# EAGLE design M6-RF315 (EAGLE 6.1)
DESIGNER: Sandor Szilvasi; DESIGNEREMAIL: sandor.szilvasi@gmail.com; PAGE1: Cover Page; PAGE2: Radio and Antenna; REVISION: A; TITLE: M6-RF315

## Sheet 1 of 2
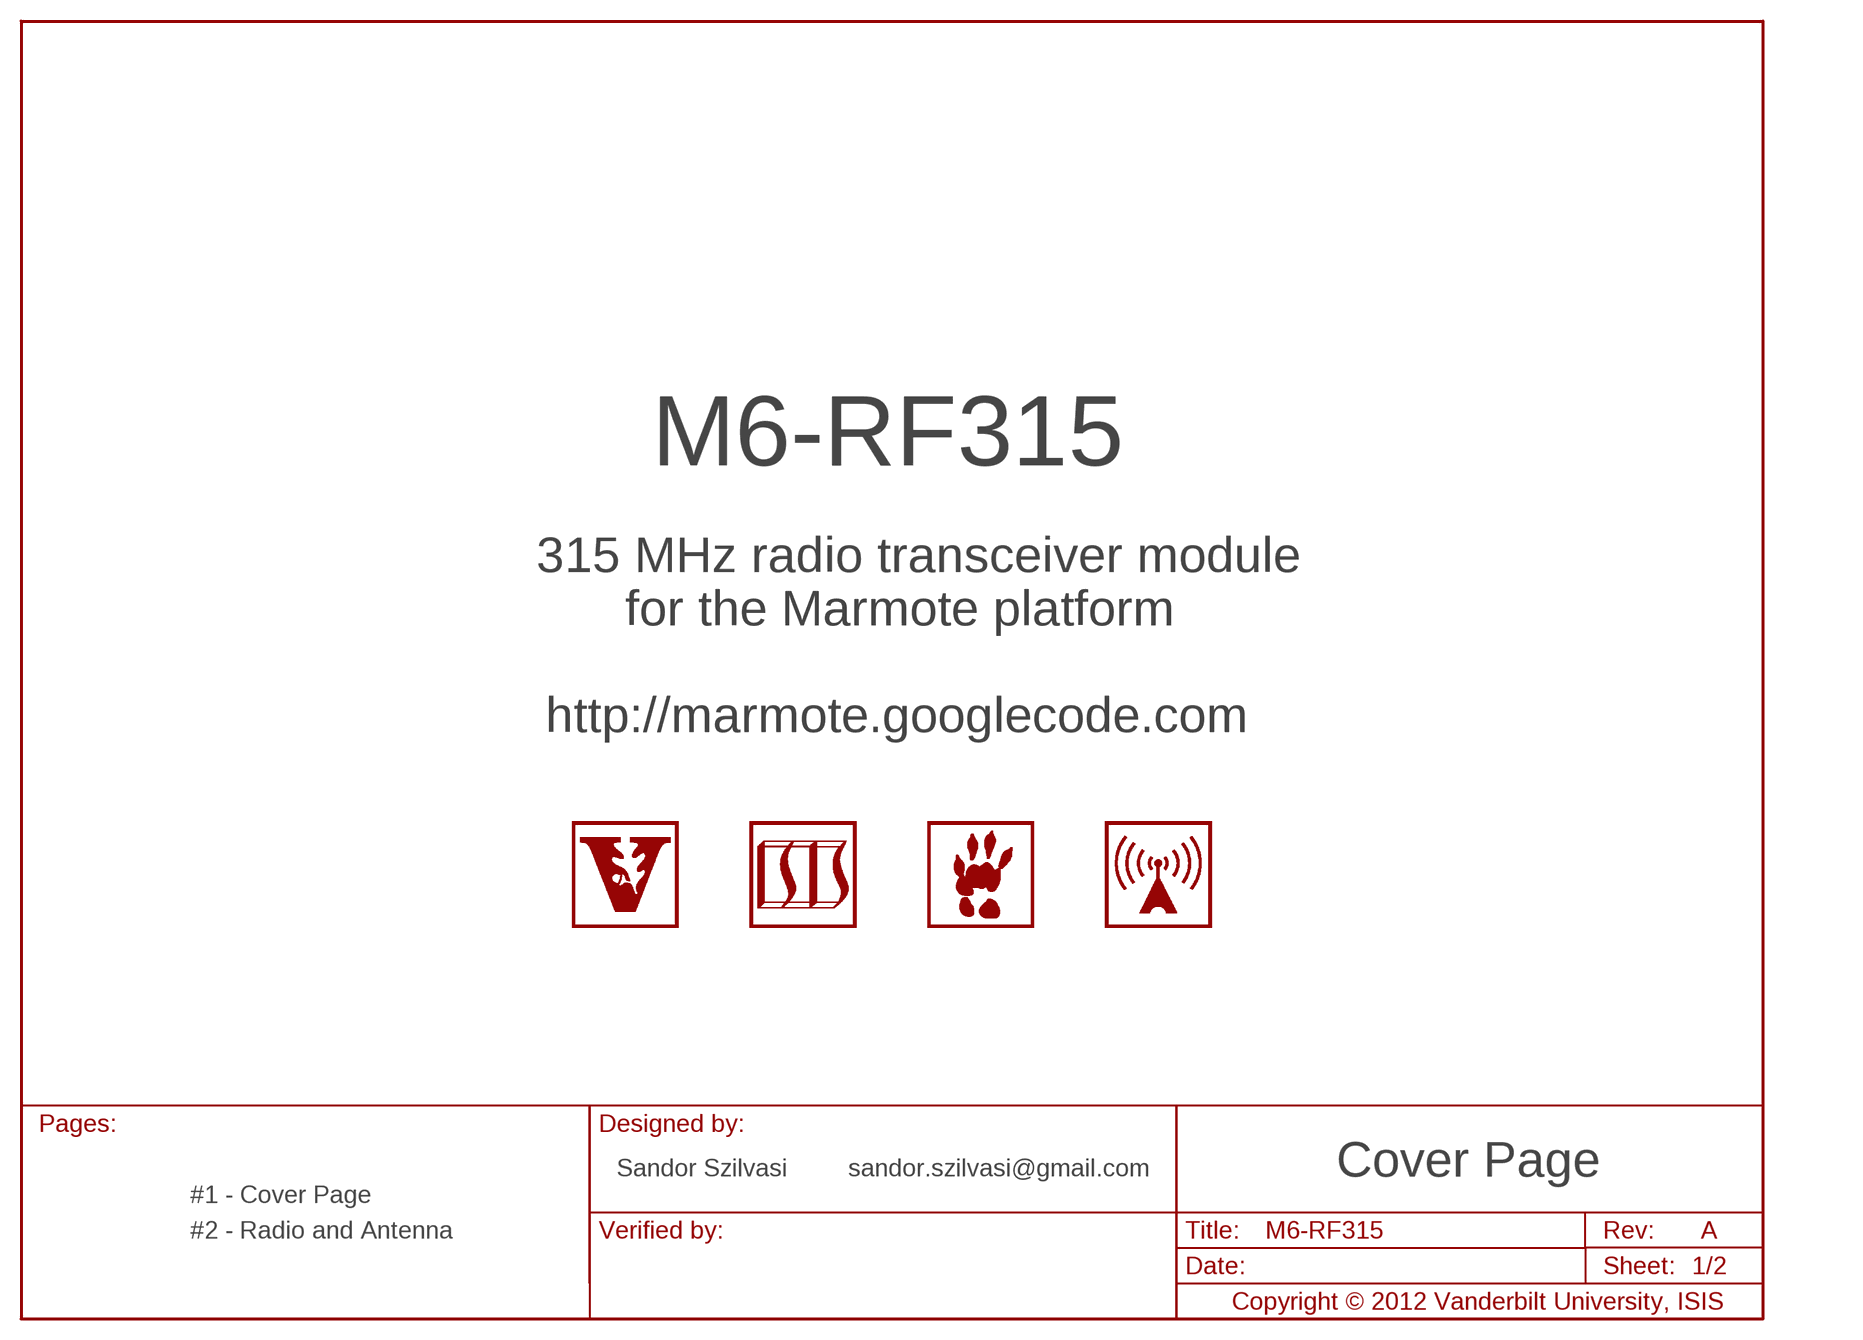
[diagram p0: schematic, sheet 1]

### Parts
LOGO1  LOGO-ISIS-600MIL-10MM-CU  [LOGO-ISIS-10MM-COPPER]
LOGO2  LOGO-MARMOTE-600MIL-10MM-CU  [LOGO-MARMOTE-10MM-COPPER]
LOGO3  LOGO-VANDERBILT-600MIL-10MM-CU  [LOGO-VANDERBILT-10MM-COPPER]
LOGO4  LOGO-RADIO-3-600MIL-10MM-CU  [LOGO-RADIO-FILLED-10MM-COPPER]

### Notes on the sheet
- 315 MHz radio transceiver module
- for the Marmote platform
- http://marmote.googlecode.com

## Sheet 2 of 2
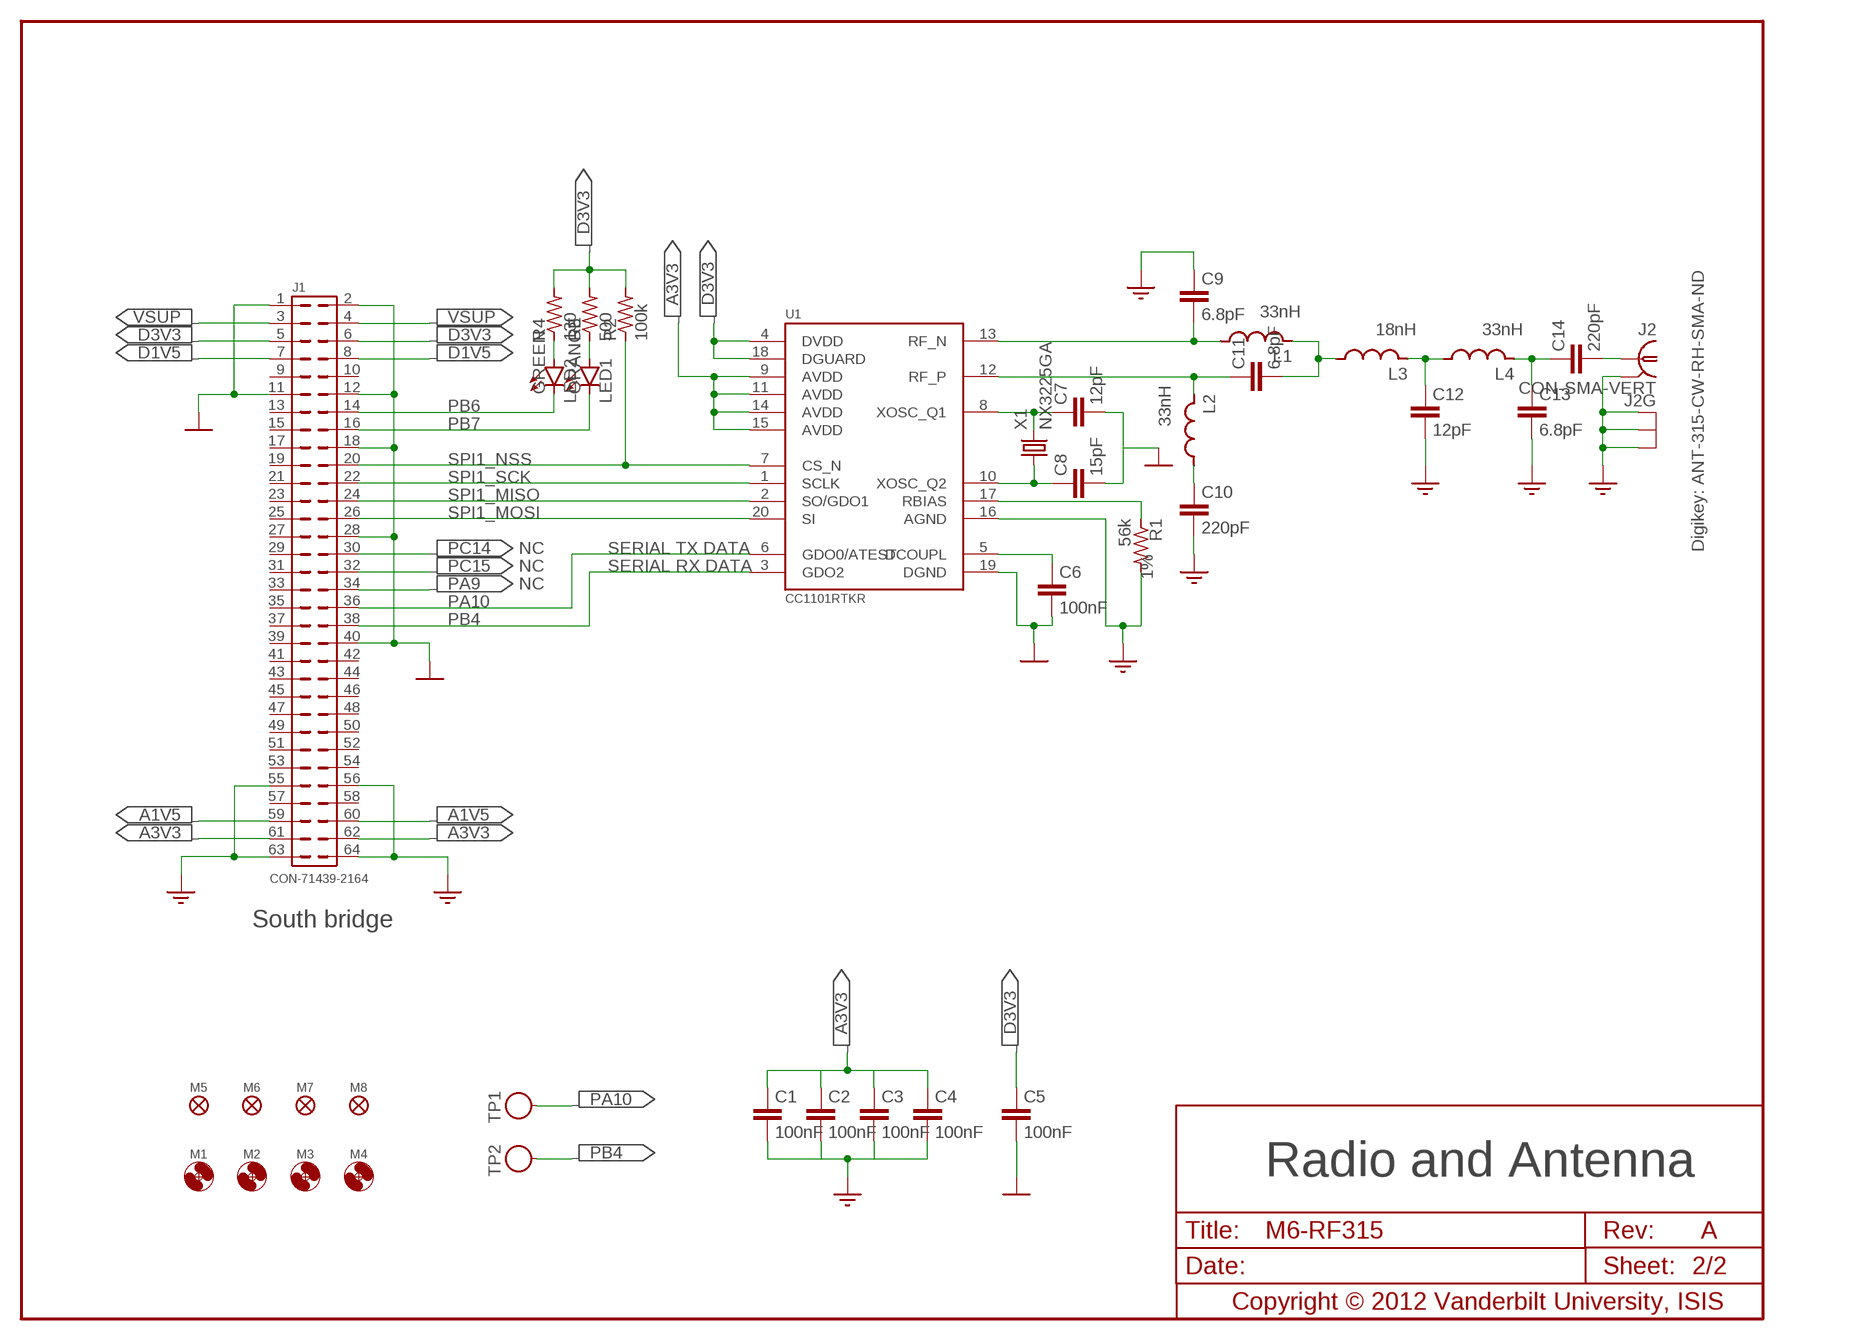
[diagram p1: schematic, sheet 2]

### Parts
C1  100nF  C0603  [C0603]
C2  100nF  C0603  [C0603]
C3  100nF  C0603  [C0603]
C4  100nF  C0603  [C0603]
C5  100nF  C0603  [C0603]
C6  100nF  C0603  [C0603]
C7  12pF  C0603  [C0603]
C8  15pF  C0603  [C0603]
C9  6.8pF  C0603  [C0603]
C10  220pF  C0603  [C0603]
C11  6.8pF  C0603  [C0603]
C12  12pF  C0603  [C0603]
C13  6.8pF  C0603  [C0603]
C14  220pF  C0603  [C0603]
J1  CON-71439-2164  [71439-XX64-BOT]
J2  CON-SMA-VERT  [SMA-VERT]
L1  33nH  L0402  [L0402]
L2  33nH  L0402  [L0402]
L3  18nH  L0402  [L0402]
L4  33nH  L0402  [L0402]
LED1  LED0603  [LED0603]
LED2  LED0603  [LED0603]
M1  MOUNT-HOLE3.3  [3,3]
M2  MOUNT-HOLE3.3  [3,3]
M3  MOUNT-HOLE3.3  [3,3]
M4  MOUNT-HOLE3.3  [3,3]
M5  FIDUCIAL1X2  [FIDUCIAL-1X2]
M6  FIDUCIAL1X2  [FIDUCIAL-1X2]
M7  FIDUCIAL1X2  [FIDUCIAL-1X2]
M8  FIDUCIAL1X2  [FIDUCIAL-1X2]
R1  56k  R0603  [R0603]
R2  100k  R0603  [R0603]
R3  500  R0603  [R0603]
R4  130  R0603  [R0603]
TP1  TESTPOINT-RED  [TESTPOINT]
TP2  TESTPOINT-RED  [TESTPOINT]
U1  CC1101RTKR  [QFN-20]
X1  NX3225GA  [NX3225GA]

### Nets
A1V5: J1.59 J1.60
A3V3: C1.1 C2.1 C3.1 C4.1 J1.61 J1.62 U1.9(AVDD) U1.11(AVDD) U1.14(AVDD) U1.15(AVDD)
AGND: C1.2 C2.2 C3.2 C4.2 C9.1 C10.2 C12.2 C13.2 J1.55 J1.56 J1.63 J1.64 J2.2(GND) J2.3(GND) J2.4(GND) J2.5(GND) R1.2 U1.16(AGND)
D1V5: J1.7 J1.8
D3V3: C5.1 J1.5 J1.6 R2.2 R3.2 R4.2 U1.4(DVDD) U1.18(DGUARD)
DGND: C5.2 C6.2 C7.2 C8.2 J1.1 J1.2 J1.11 J1.12 J1.18 J1.28 J1.40 U1.19(DGND)
N$1: LED1.A R3.1
N$2: C12.1 L3.2 L4.1
N$4: C6.1 U1.5(DCOUPL)
N$6: C8.1 U1.10(XOSC_Q2) X1.1
N$7: C7.1 U1.8(XOSC_Q1) X1.3
N$8: C11.1 L2.2 U1.12(RF_P)
N$9: C9.2 L1.1 U1.13(RF_N)
N$10: C11.2 L1.2 L3.1
N$11: C13.1 C14.1 L4.2
N$12: C14.2 J2.1
N$13: C10.1 L2.1
N$19: LED2.A R4.1
PA9: J1.34
PA10: J1.36 TP1.1 U1.6(GDO0/ATEST)
PB4: J1.38 TP2.1 U1.3(GDO2)
PB6: J1.14 LED2.C
PB7: J1.16 LED1.C
PC14: J1.30
PC15: J1.32
RBIAS: R1.1 U1.17(RBIAS)
SPI1_MISO: J1.24 U1.2(SO/GDO1)
SPI1_MOSI: J1.26 U1.20(SI)
SPI1_NSS: J1.20 R2.1 U1.7(CS_N)
SPI1_SCK: J1.22 U1.1(SCLK)
VSUP: J1.3 J1.4
Unconnected: J1.9 J1.10 J1.13 J1.15 J1.17 J1.19 J1.21 J1.23 J1.25 J1.27 J1.29 J1.31 J1.33 J1.35 J1.37 J1.39 J1.41 J1.42 J1.43 J1.44 J1.45 J1.46 J1.47 J1.48 J1.49 J1.50 J1.51 J1.52 J1.53 J1.54 J1.57 J1.58

### Notes on the sheet
- Digikey: ANT-315-CW-RH-SMA-ND
- NC | SERIAL TX DATA
- NC | SERIAL RX DATA
- NC
- South bridge

## Power pins joined to a net without a drawn wire
AGND: U1.EXP(AGND)
DGND: X1.2(DGND) X1.4(DGND)

## Library data of the parts
C1-C8 = M6-RF315:C: CAPACITOR
C9 = M6-RF315:C: CAPACITOR; FUNCTION: RF balun/matching capacitor
C10 = M6-RF315:C: CAPACITOR; FUNCTION: RF balun DC blocking capacitor
C11 = M6-RF315:C: CAPACITOR; FUNCTION: RF balun/matching capacitors
C12 = M6-RF315:C: CAPACITOR; FUNCTION: RF LC filter/matching filter capacitor
C13 = M6-RF315:C: CAPACITOR; FUNCTION: RF LC filter/matching capacitor
C14 = M6-RF315:C: CAPACITOR; FUNCTION: RF LC filter DC blocking capacitor
J1 = M6-RF315:CON-71439: Board-to-Board Connector 1.00mm (.039") Mezzanine IEEE 1386 Receptacle - Dual Row 64-pin, SMT, Vertical Stacking Source: http://www.molex.com/molex/products/datasheet.jsp?part=active/0714392164_PCB_RECEPTACLES.xml&channel=Products; DIGI-KEY#: WM17222-ND; MATED-STACKING-HEIGHT: 13mm; MF: Molex; MPN: 71439-2164
J2 = M6-RF315:CON-SMA-VERT: SMA vertical PCB thrue hole jack Source: Lighthorse Technologies, inc. SASF54GT.pdf; DIGI-KEY#: A97594-ND; MF: TE Connectivity; MPN: 5-1814832-1
L1 L2 = M6-RF315:L: INDUCTOR; FUNCTION: RF balun/matching inductor
L3 L4 = M6-RF315:L: INDUCTOR; FUNCTION: RF LC filter/matching filter inductor
LED1 = M6-RF315:LED: LED; COLOR: ORANGE; DIGI-KEY#: 754-1120-1-ND; MF: Kingbright; MILLICANDELA: 240 mcd; MPN: APT1608SECK
LED2 = M6-RF315:LED: LED; COLOR: GREEN; DIGI-KEY#: 754-1118-1-ND; MF: Kingbright; MILLICANDELA: 70 mcd; MPN: APT1608MGC
LOGO1 = M6-RF315:LOGO-ISIS-600MIL: ISIS Logo Official logo of the Institute for Software Integrated Systems (ISIS), Vanderbilt as of 2011 Generated from 360 x 360 px bitmap and scaled to 600 x 600 mil v1.0 Initial design
LOGO2 = M6-RF315:LOGO-MARMOTE-600MIL: Marmote Platform Logo Preliminary logo for the Marmote Platform (http://marmote.googlecode.com) Generated from 360 x 360 px bitmap and scaled to 600 x 600 mil v1.1 Source bitmap smoothened v1.0 Initial design
LOGO3 = M6-RF315:LOGO-VANDERBILT-600MIL: Vanderbilt Logo Official Framed Vanderbilt Logo Generated from 360 x 360 px bitmap and scaled to 600 x 600 mil v1.1 Source bitmap smoothened v1.0 Initial design
LOGO4 = M6-RF315:LOGO-RADIO-3-600MIL: Radio Logo Preliminary logo for the Marmote platform analog radio front-end module. Generated from 360 x 360 px bitmap and scaled to 600 x 600 mil v1.0 Initial design
M1-M4 = M6-RF315:MOUNT-HOLE: MOUNTING HOLE with drill center marker
M5-M8 = M6-RF315:FIDUCIAL: Fiducial Alignment Points Various fiducial points for machine vision alignment.
R1 = M6-RF315:R: RESISTOR; TOLERANCE: 1%
R2-R4 = M6-RF315:R: RESISTOR
TP1 TP2 = M6-RF315:TESTPOINT: Test Point Keystone compact through hole mount test point for SUPPLY and GROUND signals Terminal: .015 (.38) × .032 (.81) thick Phosphor Bronze Wire, Silver Plate Base: Nylon 46, UL Rated 94V-0 Mtg. Hole: .063 (1.6) Diameter Source: http://www.keyelco.com/pdfs/M55p51.pdf; DIGI-KEY#: 5005K-ND; MF: Keystone; MPN: 5005
U1 = M6-RF315:CC1101: CC1101 Texas Instruments CC1101 Radio Chip. Source: http://www.ti.com/lit/gpn/cc1101; DIGI-KEY#: 296-21981-1-ND; MF: Texas Instruments; MPN: CC1101RTKR
X1 = M6-RF315:NX3225GA: NX3225GA Crystal oscillator NDK NX3225GA small surface-mount type crystal unit in compact and thin 3.2 x 2.5 x 0.75 mm package. Source: http://www.ndk.com/images/products/catalog/c_NX3225GA-STD-CRG-1_e.pdf; DIGI-KEY#: 644-1157-1-ND; MF: NDK; MFN: NX3225GA-16.000M-STD-CRG-1

## Board
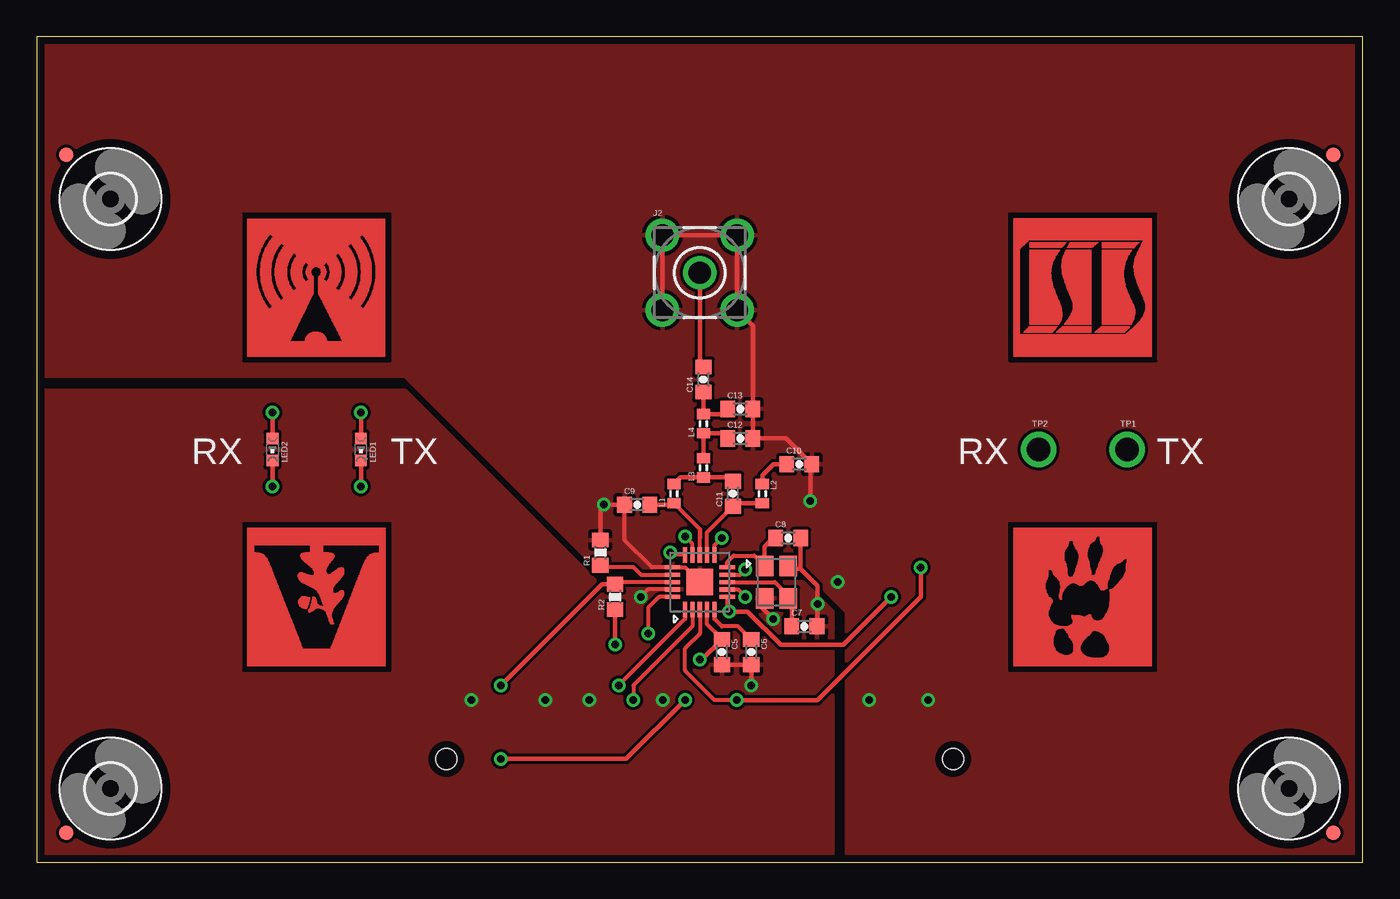
[diagram p2: board, top side]
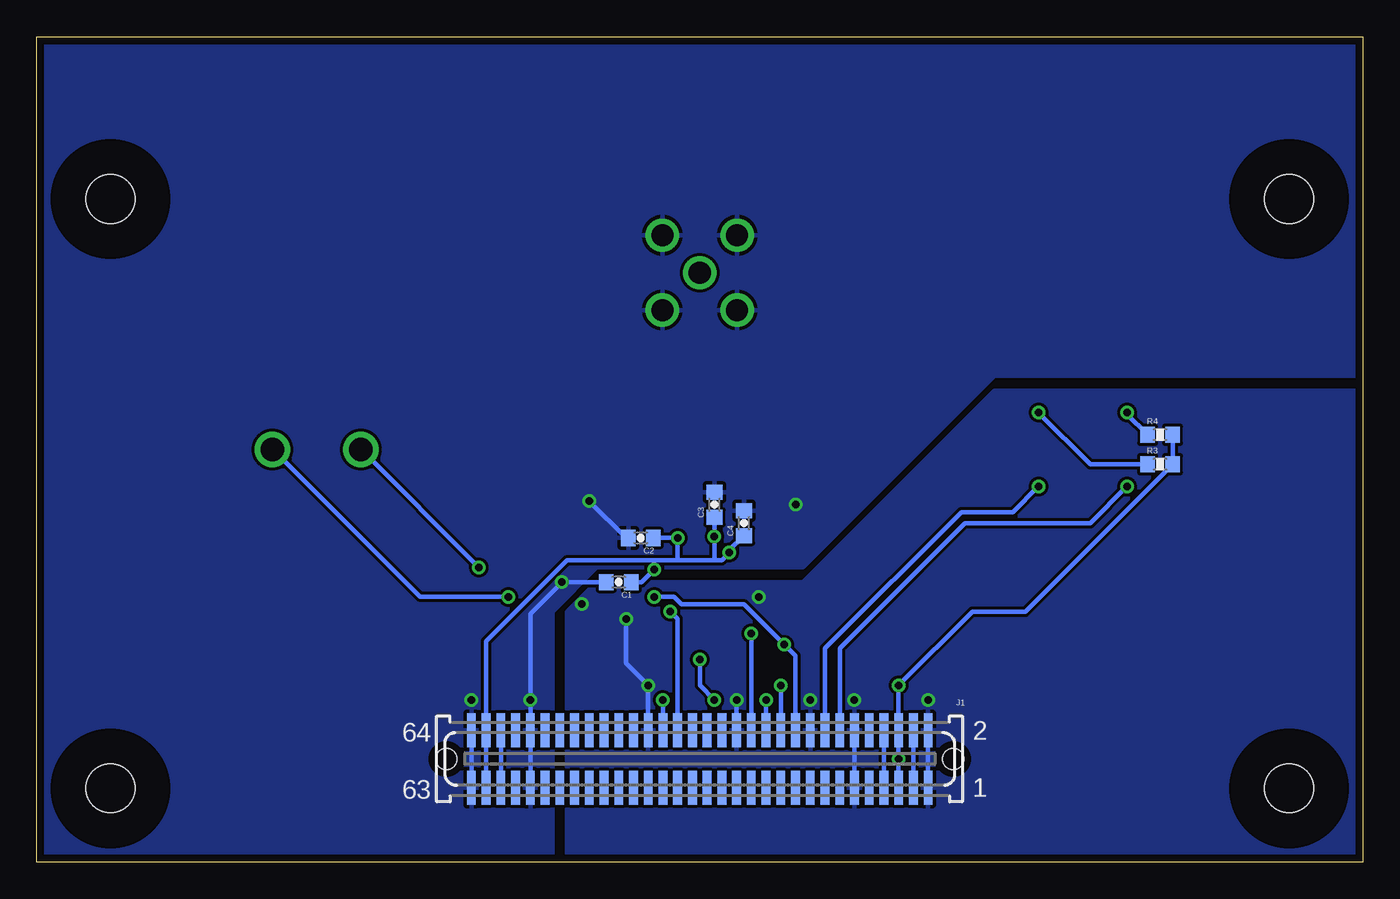
[diagram p3: board, bottom side, seen from below]

Size 90 x 56 mm. Coordinates in mm from the lower left corner, seen from the top.
Outline: 0,0 90,0 90,56 0,56 0,0
Copper layers (1*16): Top 0.035mm / dielectric 1.5mm / Bottom 0.035mm
Design rules: minimum track width 8mil, minimum drill 20mil, track to track 8mil, track to pad 8mil, pad to pad 8mil, via to via 8mil, smd to smd 8mil, copper to edge 20mil, drill to drill 8mil, minimum pad ring 10mil, minimum via ring 8mil, stop-mask expansion 4mil, vias tented up to drill 0mil, thermal gap 10mil

### Footprints (pad centres in the part's own frame; a part is rotated, then mirrored left to right if it is on the bottom)
C0603 = smd 1 x 1.1: 1 -0.85,0; 2 0.85,0
71439-XX64-BOT = smd 0.6 x 2.3: 1 -15.5,1.96; 2 -15.5,-1.96; 3 -14.5,1.96; 4 -14.5,-1.96; 5 -13.5,1.96; 6 -13.5,-1.96; 7 -12.5,1.96; 8 -12.5,-1.96; 9 -11.5,1.96; 10 -11.5,-1.96; 11 -10.5,1.96; 12 -10.5,-1.96; 13 -9.5,1.96; 14 -9.5,-1.96; 15 -8.5,1.96; 16 -8.5,-1.96; 17 -7.5,1.96; 18 -7.5,-1.96; 19 -6.5,1.96; 20 -6.5,-1.96; 21 -5.5,1.96; 22 -5.5,-1.96; 23 -4.5,1.96; 24 -4.5,-1.96; 25 -3.5,1.96; 26 -3.5,-1.96; 27 -2.5,1.96; 28 -2.5,-1.96; 29 -1.5,1.96; 30 -1.5,-1.96; 31 -0.5,1.96; 32 -0.5,-1.96; 33 0.5,1.96; 34 0.5,-1.96; 35 1.5,1.96; 36 1.5,-1.96; 37 2.5,1.96; 38 2.5,-1.96; 39 3.5,1.96; 40 3.5,-1.96; 41 4.5,1.96; 42 4.5,-1.96; 43 5.5,1.96; 44 5.5,-1.96; 45 6.5,1.96; 46 6.5,-1.96; 47 7.5,1.96; 48 7.5,-1.96; 49 8.5,1.96; 50 8.5,-1.96; 51 9.5,1.96; 52 9.5,-1.96; 53 10.5,1.96; 54 10.5,-1.96; 55 11.5,1.96; 56 11.5,-1.96; 57 12.5,1.96; 58 12.5,-1.96; 59 13.5,1.96; 60 13.5,-1.96; 61 14.5,1.96; 62 14.5,-1.96; 63 15.5,1.96; 64 15.5,-1.96 | hole 1.4: -17.2,0; 17.2,0
SMA-VERT = drill 1.5 pad 2.2: 1 0,0; 2 -2.54,2.54; 3 2.54,2.54; 4 2.54,-2.54; 5 -2.54,-2.54
L0402 = smd 0.7 x 0.9: 1 -0.65,0; 2 0.65,0
LED0603 = smd 0.8 x 0.8: A 0,0.75; C 0,-0.75
3,3 = hole 3.3: 0,0
FIDUCIAL-1X2 = smd 1 x 1: 1 0,0
R0603 = smd 1 x 1.1: 1 -0.85,0; 2 0.85,0
TESTPOINT = drill 1.6: 1 0,0
QFN-20 = smd 1.05 x 0.28: 1 -1.85,1; 2 -1.85,0.5; 3 -1.85,0; 4 -1.85,-0.5; 5 -1.85,-1; 11 1.85,-1; 12 1.85,-0.5; 13 1.85,0; 14 1.85,0.5; 15 1.85,1 | smd 0.28 x 1.05: 6 -1,-1.85; 7 -0.5,-1.85; 8 0,-1.85; 9 0.5,-1.85; 10 1,-1.85; 16 1,1.85; 17 0.5,1.85; 18 0,1.85; 19 -0.5,1.85; 20 -1,1.85 | smd 1.8 x 1.8: EXP 0,0
NX3225GA = smd 1.4 x 1.2: 1 -1.1,-0.8; 2 1.1,-0.8; 3 1.1,0.8; 4 -1.1,0.8

### Placement (x,y rotation side)
C1  50.5,19 180 bottom
C2  49,22 180 bottom
C3  44,24.25 90 bottom
C4  42,23 90 bottom
C5  46.5,14.25 270 top
C6  48.5,14.25 270 top
C7  52.1,16 0 top
C8  51,22 0 top
C9  40.75,24.25 0 top
C10  51.75,27 0 top
C11  47.25,25 90 top
C12  47.75,28.75 0 top
C13  47.75,30.75 0 top
C14  45.25,32.75 90 top
J1  45,7 180 bottom
J2  45,40 0 top
L1  43.25,25 90 top
L2  49.25,25 270 top
L3  45.25,26.75 90 top
L4  45.25,29.75 90 top
LED1  22,28 0 top
LED2  16,28 0 top
LOGO1  66,34 0 top
LOGO2  66,13 0 top
LOGO3  14,13 0 top
LOGO4  14,34 0 top
M1  5,5 0 top
M2  5,45 0 top
M3  85,45 0 top
M4  85,5 0 top
M5  2,2 0 top
M6  2,48 0 top
M7  88,48 0 top
M8  88,2 0 top
R1  38.25,21 90 top
R2  39.25,18 90 top
R3  13.75,27 0 bottom
R4  13.75,29 0 bottom
TP1  74,28 0 top
TP2  68,28 0 top
U1  45,19 90 top
X1  50.2,19 270 top

### Tracks (layer width: path | path; a pad name or v marks a point on that pad's centre or on a via)
A1V5
  Bottom 0.305: J1.60 J1.59
A3V3  (via drill 0.51)
  Top 0.279: U1.11 46,21.5 v46.5,22 | U1.9 47.75,19.5 v48.1,19.85 | U1.14 44.5,21.6 v44,22.1 | U1.15 43.15,20.85 v43,21
  Bottom 0.305: C3.1 v44,22.1 44,20.5 | J1.61 J1.62 59.5,15 54,20.5 48.1,20.5 | 48.1,20.5 46.5,20.5 | 46.5,20.5 v46.5,22 C2.1 | 48.1,20.5 v48.1,19.85 48.95,19 C1.1 | C4.1 43,21.15 v43,21 43.5,20.5 44,20.5 | 44,20.5 46.5,20.5
AGND  (via drill 0.51)
  Top 0.279: U1.EXP 44,20 U1.16 41.75,20 39.9,21.85 C9.1
  Top 0.305: R1.2 38.25,24 v38.5,24.25 C9.1 | J2.5 J2.2 J2.3 J2.4 48.6,36.4 C13.2 C12.2 50.85,28.75 C10.2 52.5,26.9 v52.5,24.5
  Bottom 0.305: J1.55 J1.56 v56.5,11 56.5,16.85 v54.35,19 C1.2 51,19 | J1.64 J1.63 | C2.2 50,22 v52.5,24.5
  other vias: 60.5,11
  pour Top: 0,56 90,56 90,0 55,0 55,17 52,20 38,20 25,33 0,33
  pour Bottom: 0,56 90,56 90,0 55,0 55,17 52,20 38,20 25,33 0,33
D1V5
  Bottom 0.305: J1.8 J1.7
D3V3  (via drill 0.51)
  Top 0.279: 46.5,15.15 45.5,16.15 U1.4 | U1.18 39.4,19
  Top 0.305: 46.5,15.15 C5.1 | C5.1 46.5,14.75 | v31.5,12 38.35,18.85 R2.2 39.4,19 | v31.5,7 40,7 v44,11 | C5.1 45.15,13.75 v45,13.75
  Bottom 0.305: R4.2 R3.2 22.9,17 26.5,17 v31.5,12 J1.6 v31.5,7 J1.5 | v44,11 45,12 v45,13.75
DGND  (via drill 0.51)
  Top 0.279: U1.19 41.5,18.5 v41,18
  Top 0.305: X1.2 49.2,17.3 v50,16.5 | C8.2 51.85,19.9 | 51.85,19.9 53,18.75 v53,17.5 53,16.05 C7.2 | X1.4 51,19.9 51.85,19.9 | C5.2 C6.2 v48.5,12
  Bottom 0.305: J1.40 v48.5,12 50,13.5 v50,16.5 | J1.11 J1.12 | J1.1 J1.2 | J1.28 v42.5,11
  other vias: 29.5,11 37.5,11 34.5,11
  pour Top: 0,0 54,0 54,17 52,19 38,19 25,32 0,32
  pour Bottom: 0,0 54,0 54,17 52,19 38,19 25,32 0,32
N$1  (via drill 0.51)
  Top 0.305: LED1.A v22,30.5
  Bottom 0.305: v22,30.5 18.5,27 R3.1
N$2
  Top 0.305: L3.2 L4.1 46.55,29.1 C12.1
N$4
  Top 0.279: U1.5 46,16.5 46.5,16 47.6,16 C6.1
N$6
  Top 0.279: U1.10 46.85,20.35 47.3,20.8 48.7,20.8 X1.1
  Top 0.305: 49.1,20 X1.1 49.4,21.4 50,22 C8.1
N$7
  Top 0.279: U1.8 50.1,19 51,18.1 51,18
  Top 0.305: 51,18 50.9,18 X1.3 | X1.3 51,17.7 | 51.15,17.55 X1.3 | C7.1 51.25,17.65 X1.3
N$8
  Top 0.279: U1.12 45.5,22.4 C11.1
  Top 0.305: L2.2 47.45,24.35 C11.1
N$9
  Top 0.279: U1.13 45,22 | L1.1 45,22.6
  Top 0.305: 45,22 45,22.4 45,22.6 | L1.1 43.15,24.25 C9.2
N$10
  Top 0.305: L1.2 43.7,26.1 L3.1 47,26.1 C11.2
N$11
  Top 0.305: C14.1 L4.2 46.55,30.4 C13.1
N$12
  Top 0.305: J2.1 45,33.85 C14.2
N$13
  Top 0.305: 51,27 C10.1 50,27 49.25,26.25 L2.1
N$19  (via drill 0.51)
  Top 0.305: LED2.A v16,30.5
  Bottom 0.305: R4.1 16,30.4 v16,30.5
PA10  (via drill 0.51)
  Top 0.279: U1.6 46.85,17.15
  Top 0.305: 46.85,17.15 v47,17 48.25,17 50.5,14.75 54.75,14.75 v58,18
  Bottom 0.305: J1.36 46.5,16.5 v47,17 | v58,18 64,18 TP1.1
PB4  (via drill 0.51)
  Top 0.279: U1.3 45,15.5 44,14.5 44,13 46,11 v47.5,11
  Top 0.305: v47.5,11 53,11 60,18 v60,20
  Bottom 0.305: v47.5,11 J1.38 | v60,20 TP2.1
PB6  (via drill 0.51)
  Top 0.305: v16,25.5 LED2.C
  Bottom 0.305: J1.14 35.5,14.5 27,23 18.5,23 v16,25.5
PB7  (via drill 0.51)
  Top 0.305: LED1.C v22,25.5
  Bottom 0.305: J1.16 36.5,14.5 27.25,23.75 23.75,23.75 v22,25.5
RBIAS
  Top 0.279: 38.4,20 40.5,20 41,19.5 U1.17
  Top 0.305: 38.4,20 R1.1
SPI1_MISO  (via drill 0.51)
  Top 0.279: U1.2 44.5,16 40.5,12 v40.5,11
  Bottom 0.305: v40.5,11 J1.24
SPI1_MOSI  (via drill 0.51)
  Top 0.279: U1.20 42.25,18 41.5,17.25 v41.5,15.5
  Bottom 0.305: v41.5,15.5 J1.26
SPI1_NSS  (via drill 0.51)
  Top 0.279: U1.7 47.6,18.5 v48.1,18
  Top 0.305: v39.25,14.75 R2.1
  Bottom 0.305: v48.1,18 46.75,18 46.25,17.5 42,17.5 v39.25,14.75 38.5,14 J1.20
SPI1_SCK  (via drill 0.51)
  Top 0.279: U1.1 44,16.5 v39.5,12
  Bottom 0.305: v39.5,12 J1.22
VSUP
  Bottom 0.305: J1.4 J1.3

### Text on the board
tPlace: RX | TX | RX | TX